# Altium schematic sheet Block Diagram.SchDoc
size A3; Engineer: Hamit Karatas; SheetNumber: 1; SheetTotal: 2
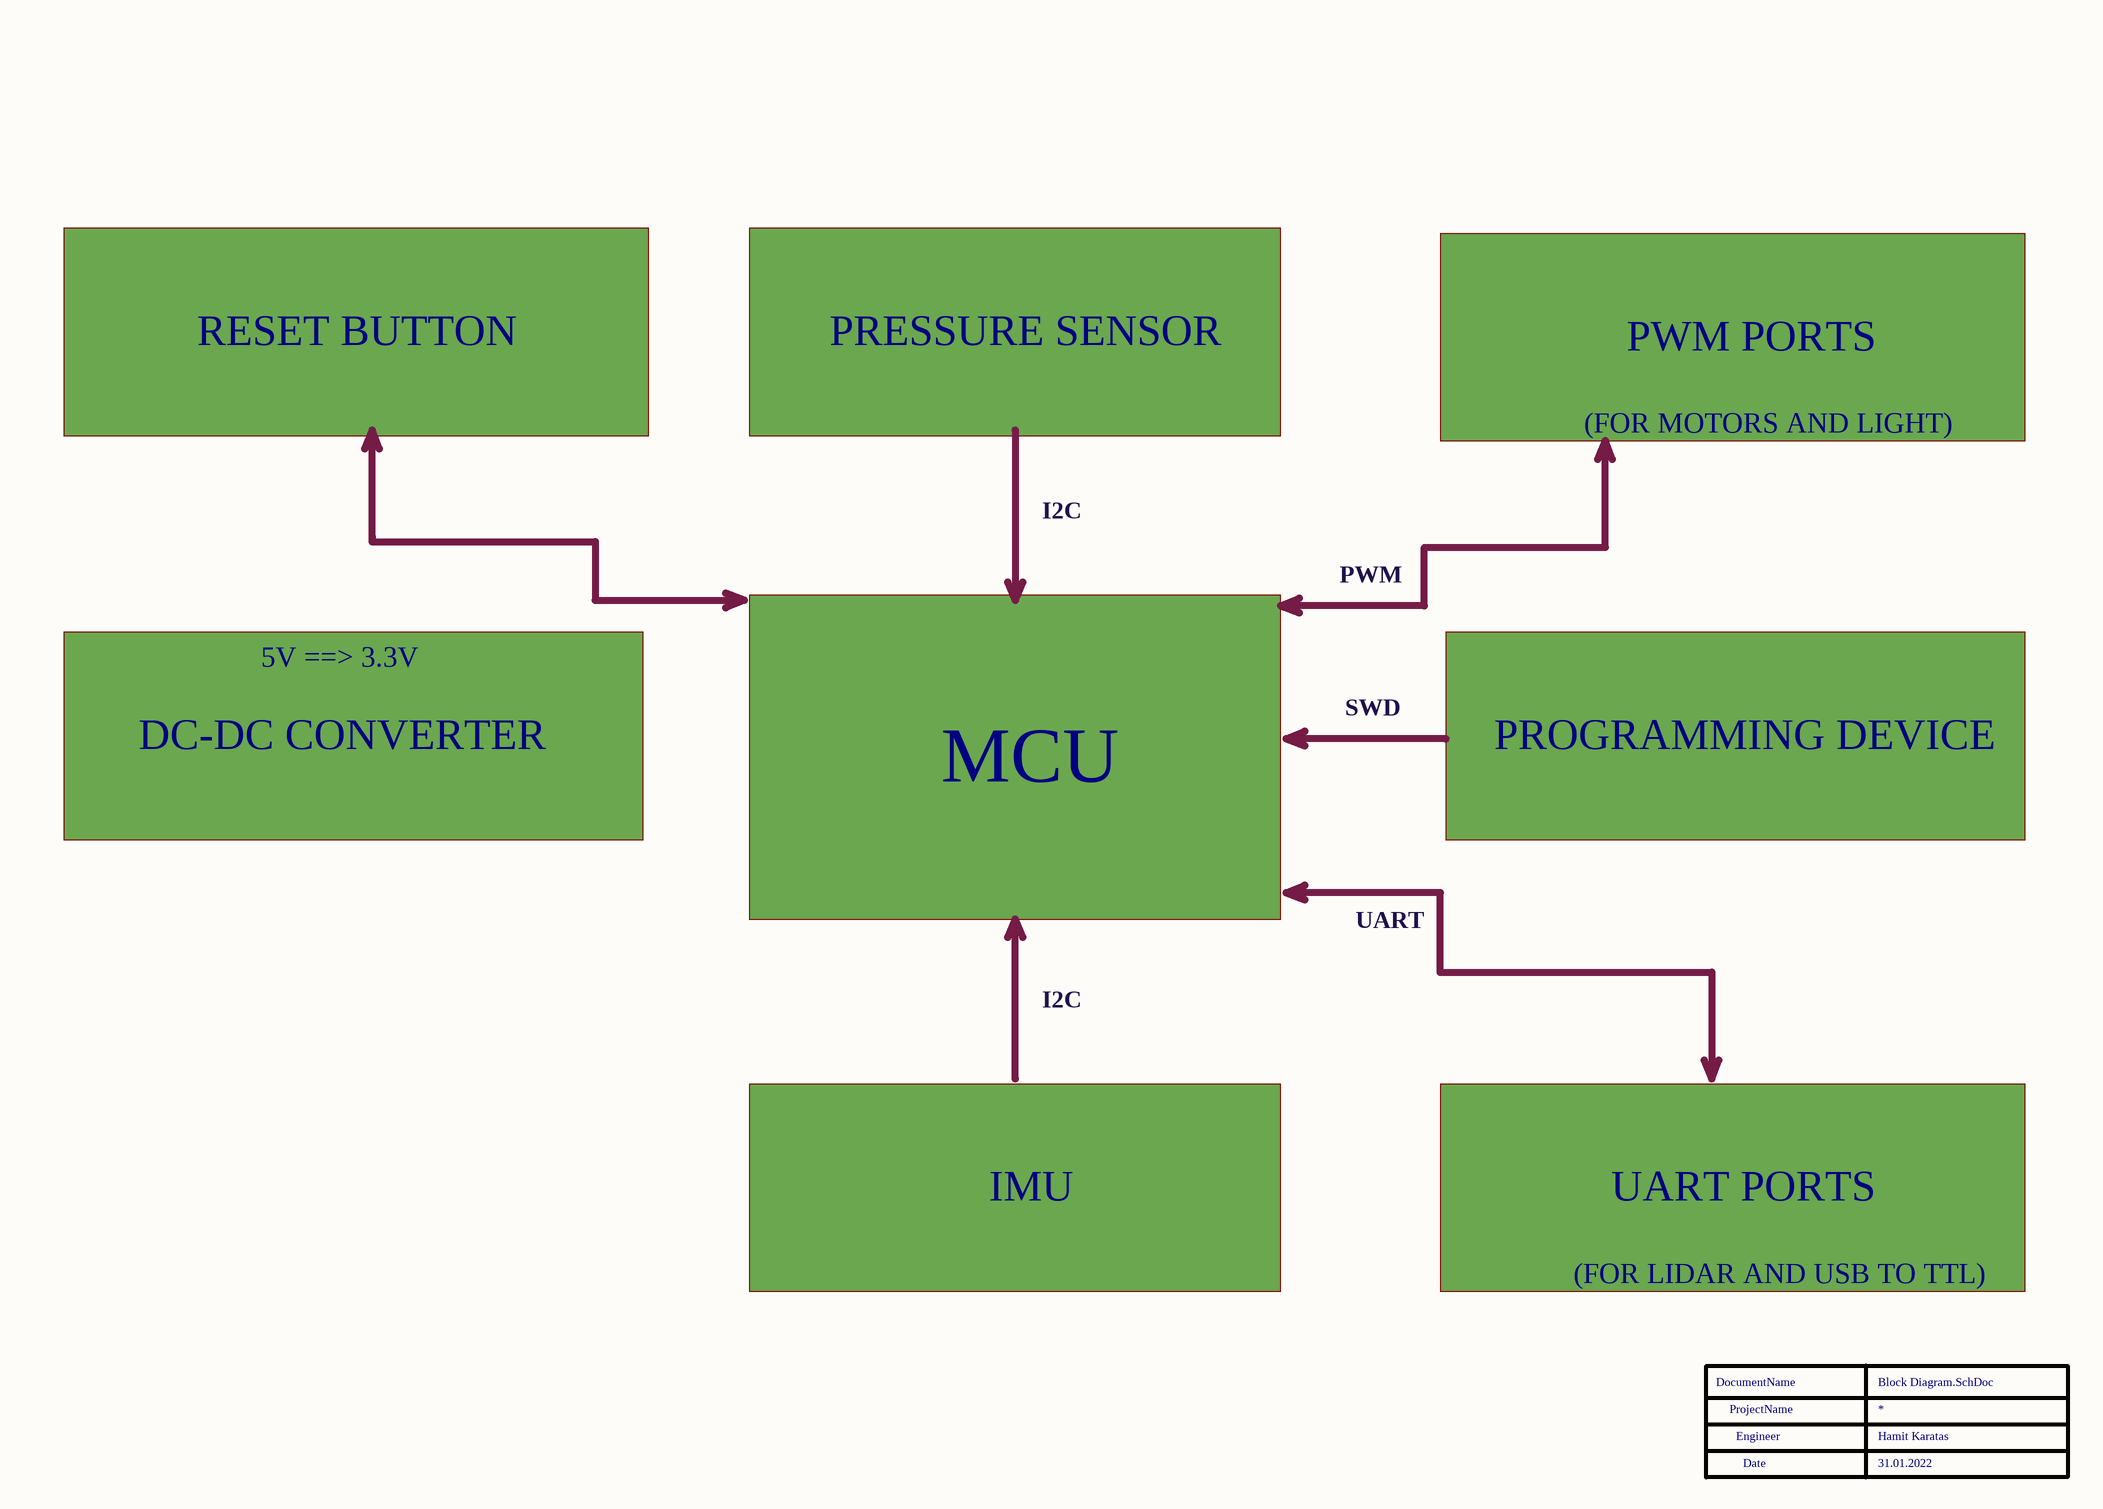
[diagram p0: Block Diagram.SchDoc]

## Notes on the sheet
- RESET BUTTON
- PRESSURE SENSOR
- PWM PORTS
- (FOR MOTORS AND LIGHT)
- I2C
- PWM
- 5V ==> 3.3V
- SWD
- DC-DC CONVERTER
- PROGRAMMING DEVICE
- MCU
- UART
- IMU
- UART PORTS
- (FOR LIDAR AND USB TO TTL)
- DocumentName
- ProjectName
- Engineer
- Date
- 31.01.2022
- THIS DOCUMENT AND THE DATA DISCLOSED HEREIN OR
- HEREWITH IS THE PROPERTY OF ALTIUM LIMITED AND MAY
- DWG NO:
- REVISION
- REV:
- DESCRIPTION
- DATE
- APPROVED
- BE FREELY DISTRIBUTED IN WHOLE. NO RIGHTS ARE
- RESERVED OR EXPRESS OR IMPLIED WARANTEE GIVEN.
- ENG:
- APPROVALS
- PROJECT
- DSN:
- CHK:
- REFERENCE DOCUMENTS
- PROJECT REVISION:
- TITLE
- DOCUMENT REVISION:
- DESIGN ITEM:
- BOM:
- FAB DWG:
- PCB DWG:
- ASSY DWG:
- SCALE:
- A3
- SIZE
- CAGE CODE
- FILE NAME
- DWG NO.
- SHEET
- OF
- REV
- 31.01.2000